# Altium schematic sheet STM32_Nucleo_144.SchDoc: Humpback
size 420 x 297 mm; Author: G.Kasprowicz; CompanyName: WUT ISE; DrawnBy: G.Kasprowicz; Organization: WUT ISE; Address1: PW ISE; Address2: Nowowiejska 15/19 00-665 Warsaw; Address3: gkasprow@gmail.com; DocumentNumber: 7; Revision: 1.0; SheetNumber: 7; SheetTotal: 11; ModifiedBy: -; CheckedDate: -; Title2: STM32 Nucleo / Arduino v1.0; DivGrp: WUT ISE; Designer: G.Kasprowicz; ModifiedDate: -; ProjectName: Sensor Box
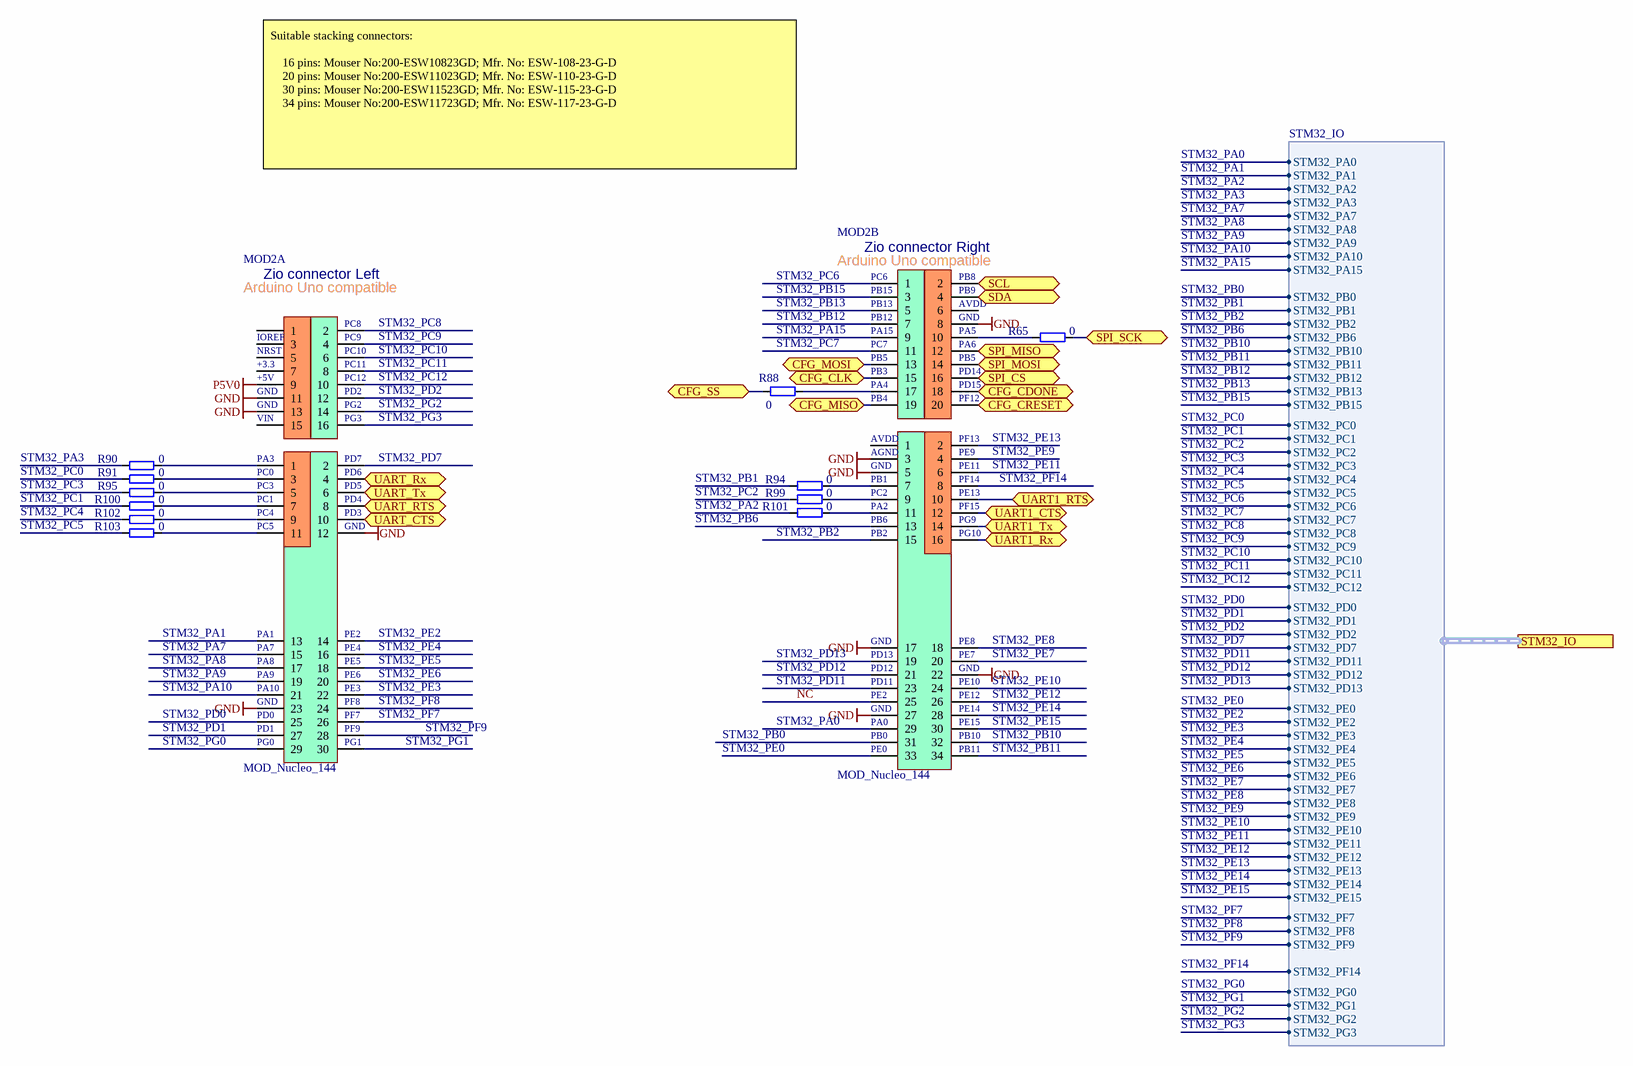
[diagram p0: STM32_Nucleo_144.SchDoc]

## Parts
MOD2  MOD_Nucleo_144  [MOD_STM32_Nucleo_144]  (parts A,B of 2)
R65  0  [RESC1608X55N]
R88  0  [RESC1608X55N]
R90  0  [RESC1608X55N]
R91  0  [RESC1608X55N]
R94  0  [RESC1608X55N]
R95  0  [RESC1608X55N]
R99  0  [RESC1608X55N]
R100  0  [RESC1608X55N]
R101  0  [RESC1608X55N]
R102  0  [RESC1608X55N]
R103  0  [RESC1608X55N]

## Ports
CFG_CDONE (bidir), CFG_CLK (bidir), CFG_CRESET (bidir), CFG_MISO (bidir), CFG_MOSI (bidir), CFG_SS (bidir), SCL (bidir), SDA (bidir), SPI_CS (bidir), SPI_MISO (bidir), SPI_MOSI (bidir), SPI_SCK (bidir), STM32_IO (harness STM32_IO), UART1_CTS (bidir), UART1_RTS (bidir), UART1_Rx (bidir), UART1_Tx (bidir), UART_CTS (bidir), UART_RTS (bidir), UART_Rx (bidir), UART_Tx (bidir)

## Harnesses
STM32_IO: STM32_PA0, STM32_PA1, STM32_PA2, STM32_PA3, STM32_PA7, STM32_PA8, STM32_PA9, STM32_PA10, STM32_PA15, STM32_PB0, STM32_PB1, STM32_PB2, STM32_PB6, STM32_PB10, STM32_PB11, STM32_PB12, STM32_PB13, STM32_PB15, STM32_PC0, STM32_PC1, STM32_PC2, STM32_PC3, STM32_PC4, STM32_PC5, STM32_PC6, STM32_PC7, STM32_PC8, STM32_PC9, STM32_PC10, STM32_PC11, STM32_PC12, STM32_PD0, STM32_PD1, STM32_PD2, STM32_PD7, STM32_PD11, STM32_PD12, STM32_PD13, STM32_PE0, STM32_PE2, STM32_PE3, STM32_PE4, STM32_PE5, STM32_PE6, STM32_PE7, STM32_PE8, STM32_PE9, STM32_PE10, STM32_PE11, STM32_PE12, STM32_PE13, STM32_PE14, STM32_PE15, STM32_PF7, STM32_PF8, STM32_PF9, STM32_PF14, STM32_PG0, STM32_PG1, STM32_PG2, STM32_PG3

## Nets
GND: MOD2.3d(3) MOD2.5d(5) MOD2.8c(8) MOD2.11a(11) MOD2.12b(12) MOD2.13a(13) MOD2.17d(17) MOD2.22d(22) MOD2.23b(23) MOD2.27d(27)
P5V0: MOD2.9a(9)
CFG_CDONE: MOD2.18c(18) ; port CFG_CDONE
CFG_CLK: MOD2.15c(15) ; port CFG_CLK
CFG_CRESET: MOD2.20c(20) ; port CFG_CRESET
CFG_MISO: MOD2.19c(19) ; port CFG_MISO
CFG_MOSI: MOD2.13c(13) ; port CFG_MOSI
CFG_SS: R88.1 ; port CFG_SS
NC: MOD2.25d(25)
SCL: MOD2.2c(2) ; port SCL
SDA: MOD2.4c(4) ; port SDA
SPI_CS: MOD2.16c(16) ; port SPI_CS
SPI_MISO: MOD2.12c(12) ; port SPI_MISO
SPI_MOSI: MOD2.14c(14) ; port SPI_MOSI
SPI_SCK: R65.2 ; port SPI_SCK
STM32_PA0: MOD2.29d(29) ; port STM32_IO.STM32_PA0
STM32_PA1: MOD2.13b(13) ; port STM32_IO.STM32_PA1
STM32_PA2: R101.1 ; port STM32_IO.STM32_PA2
STM32_PA3: R90.1 ; port STM32_IO.STM32_PA3
STM32_PA7: MOD2.15b(15) ; port STM32_IO.STM32_PA7
STM32_PA8: MOD2.17b(17) ; port STM32_IO.STM32_PA8
STM32_PA9: MOD2.19b(19) ; port STM32_IO.STM32_PA9
STM32_PA10: MOD2.21b(21) ; port STM32_IO.STM32_PA10
STM32_PA15: MOD2.9c(9) ; port STM32_IO.STM32_PA15
STM32_PB0: MOD2.31d(31) ; port STM32_IO.STM32_PB0
STM32_PB1: R94.1 ; port STM32_IO.STM32_PB1
STM32_PB2: MOD2.15d(15) ; port STM32_IO.STM32_PB2
STM32_PB6: MOD2.13d(13) ; port STM32_IO.STM32_PB6
STM32_PB10: MOD2.32d(32) ; port STM32_IO.STM32_PB10
STM32_PB11: MOD2.34d(34) ; port STM32_IO.STM32_PB11
STM32_PB12: MOD2.7c(7) ; port STM32_IO.STM32_PB12
STM32_PB13: MOD2.5c(5) ; port STM32_IO.STM32_PB13
STM32_PB15: MOD2.3c(3) ; port STM32_IO.STM32_PB15
STM32_PC0: R91.1 ; port STM32_IO.STM32_PC0
STM32_PC1: R100.1 ; port STM32_IO.STM32_PC1
STM32_PC2: R99.1 ; port STM32_IO.STM32_PC2
STM32_PC3: R95.1 ; port STM32_IO.STM32_PC3
STM32_PC4: R102.1 ; port STM32_IO.STM32_PC4
STM32_PC5: R103.1 ; port STM32_IO.STM32_PC5
STM32_PC6: MOD2.1c(1) ; port STM32_IO.STM32_PC6
STM32_PC7: MOD2.11c(11) ; port STM32_IO.STM32_PC7
STM32_PC8: MOD2.2a(2) ; port STM32_IO.STM32_PC8
STM32_PC9: MOD2.4a(4) ; port STM32_IO.STM32_PC9
STM32_PC10: MOD2.6a(6) ; port STM32_IO.STM32_PC10
STM32_PC11: MOD2.8a(8) ; port STM32_IO.STM32_PC11
STM32_PC12: MOD2.10a(10) ; port STM32_IO.STM32_PC12
STM32_PD0: MOD2.25b(25) ; port STM32_IO.STM32_PD0
STM32_PD1: MOD2.27b(27) ; port STM32_IO.STM32_PD1
STM32_PD2: MOD2.12a(12) ; port STM32_IO.STM32_PD2
STM32_PD7: MOD2.2b(2) ; port STM32_IO.STM32_PD7
STM32_PD11: MOD2.23d(23) ; port STM32_IO.STM32_PD11
STM32_PD12: MOD2.21d(21) ; port STM32_IO.STM32_PD12
STM32_PD13: MOD2.19d(19) ; port STM32_IO.STM32_PD13
STM32_PE0: MOD2.33d(33) ; port STM32_IO.STM32_PE0
STM32_PE2: MOD2.14b(14) ; port STM32_IO.STM32_PE2
STM32_PE3: MOD2.22b(22) ; port STM32_IO.STM32_PE3
STM32_PE4: MOD2.16b(16) ; port STM32_IO.STM32_PE4
STM32_PE5: MOD2.18b(18) ; port STM32_IO.STM32_PE5
STM32_PE6: MOD2.20b(20) ; port STM32_IO.STM32_PE6
STM32_PE7: MOD2.20d(20) ; port STM32_IO.STM32_PE7
STM32_PE8: MOD2.18d(18) ; port STM32_IO.STM32_PE8
STM32_PE9: MOD2.4d(4) ; port STM32_IO.STM32_PE9
STM32_PE10: MOD2.24d(24) ; port STM32_IO.STM32_PE10
STM32_PE11: MOD2.6d(6) ; port STM32_IO.STM32_PE11
STM32_PE12: MOD2.26d(26) ; port STM32_IO.STM32_PE12
STM32_PE13: MOD2.2d(2) ; port STM32_IO.STM32_PE13
STM32_PE14: MOD2.28d(28) ; port STM32_IO.STM32_PE14
STM32_PE15: MOD2.30d(30) ; port STM32_IO.STM32_PE15
STM32_PF7: MOD2.26b(26) ; port STM32_IO.STM32_PF7
STM32_PF8: MOD2.24b(24) ; port STM32_IO.STM32_PF8
STM32_PF9: MOD2.28b(28) ; port STM32_IO.STM32_PF9
STM32_PF14: MOD2.8d(8) ; port STM32_IO.STM32_PF14
STM32_PG0: MOD2.29b(29) ; port STM32_IO.STM32_PG0
STM32_PG1: MOD2.30b(30) ; port STM32_IO.STM32_PG1
STM32_PG2: MOD2.14a(14) ; port STM32_IO.STM32_PG2
STM32_PG3: MOD2.16a(16) ; port STM32_IO.STM32_PG3
UART1_CTS: MOD2.12d(12) ; port UART1_CTS
UART1_RTS: MOD2.10d(10) ; port UART1_RTS
UART1_Rx: MOD2.16d(16) ; port UART1_Rx
UART1_Tx: MOD2.14d(14) ; port UART1_Tx
UART_CTS: MOD2.10b(10) ; port UART_CTS
UART_RTS: MOD2.8b(8) ; port UART_RTS
UART_Rx: MOD2.4b(4) ; port UART_Rx
UART_Tx: MOD2.6b(6) ; port UART_Tx
NetMOD2_1b: MOD2.1b(1) R90.2
NetMOD2_3b: MOD2.3b(3) R91.2
NetMOD2_5b: MOD2.5b(5) R95.2
NetMOD2_7b: MOD2.7b(7) R100.2
NetMOD2_7d: MOD2.7d(7) R94.2
NetMOD2_9b: MOD2.9b(9) R102.2
NetMOD2_9d: MOD2.9d(9) R99.2
NetMOD2_10c: MOD2.10c(10) R65.1
NetMOD2_11b: MOD2.11b(11) R103.2
NetMOD2_11d: MOD2.11d(11) R101.2
NetMOD2_17c: MOD2.17c(17) R88.2

Not connected (* = marked no-connect by the designer): MOD2 1a(1) 1d(1) 3a(3) 5a(5) 6c(6) 7a(7) 15a(15)

## Notes on the sheet
- Suitable stacking connectors:
  16 pins: Mouser No:200-ESW10823GD; Mfr. No: ESW-108-23-G-D
  20 pins: Mouser No:200-ESW11023GD; Mfr. No: ESW-110-23-G-D
  30 pins: Mouser No:200-ESW11523GD; Mfr. No: ESW-115-23-G-D
  34 pins: Mouser No:200-ESW11723GD; Mfr. No: ESW-117-23-G-D
- Project/Equipment
- Document
- Designer
- Drawn by
- Check.by
- Copyright WUT ISE 2018.
  This documentation describes Open Hardware and is licensed under the CERN OHL v.1.1. You may redistribute and modify this documentation under the terms of the CERN OHL v.1.1. (http://ohwr.org/CERNOHL). This documentation is distributed WITHOUT ANY EXPRESS OR IMPLIED WARRANTY, INCLUDING OF MERCHANTABILITY, SATISFACTORY QUALITY AND FITNESS FOR A PARTICULAR PURPOSE. Please see the CERN OHL v.1.1 for applicable conditions.
- Contact
- File
- Last Mod.
- Print Date
- Sheet
- Size
- A3
- of
- Rev
- (in symbol MOD_Nucleo_144, part A) Zio connector Left; Arduino Uno compatible; PC8; IOREF; PC9; NRST; PC10; +3.3; PC11; +5V; PC12; GND; PD2; PG2; VIN; PG3; PA3; PD7; PC0; PD6; PC3; PD5; PC1; PD4; PC4; PD3; PC5; PA1; PE2; PA7; PE4; PA8; PE5; PA9; PE6; PA10; PE3; PF8; PD0; PF7; PD1; PF9; PG0; PG1
- (in symbol MOD_Nucleo_144, part B) Zio connector Right; Arduino Uno compatible; PC6; PB8; PB15; PB9; PB13; AVDD; PB12; GND; PA15; PA5; PC7; PA6; PB5; PB3; PD14; PA4; PD15; PB4; PF12; PF13; AGND; PE9; PE11; PB1; PF14; PC2; PE13; PA2; PF15; PB6; PG9; PB2; PG10; PE8; PD13; PE7; PD12; PD11; PE10; PE2; PE12; PE14; PA0; PE15; PB0; PB10; PE0; PB11

## Library data of the parts
R65 R88 R90 R91 R94 R95 R99-R103 = R0603_0R_JUMPER: Resistor; Part Description: 1A (0.05R Max DC Resistance) Zero Ohm Jumper; Manufacturer: GENERIC; Manufacturer1 Part Number: NRC06Z0; PressFit: No; Part Number: R0603_0R_JUMPER; Component Kind: Standard; Component Type: Standard; Pin Count: 2; Value: 0; Status: Preferred; Manufacturer Part Number: R0603_0R_JUMPER; Case: 0603; Mounted: Yes; Sense: No; Socket: No; SMD: Yes; Manufacturer1 Example: NIC COMPONENT; Manufacturer1 ComponentHeight: 0.55mm; HelpURL: \\cern.ch\dfs\Applications\Altium\Datasheets\R0603_NIC_NRC.pdf; Author: CERN DEM JLC; CreateDate: 03.12.2007; LatestRevisionDate: 13.03.2008